# Altium schematic sheet e3_tp1_ej1.SchDoc
size A
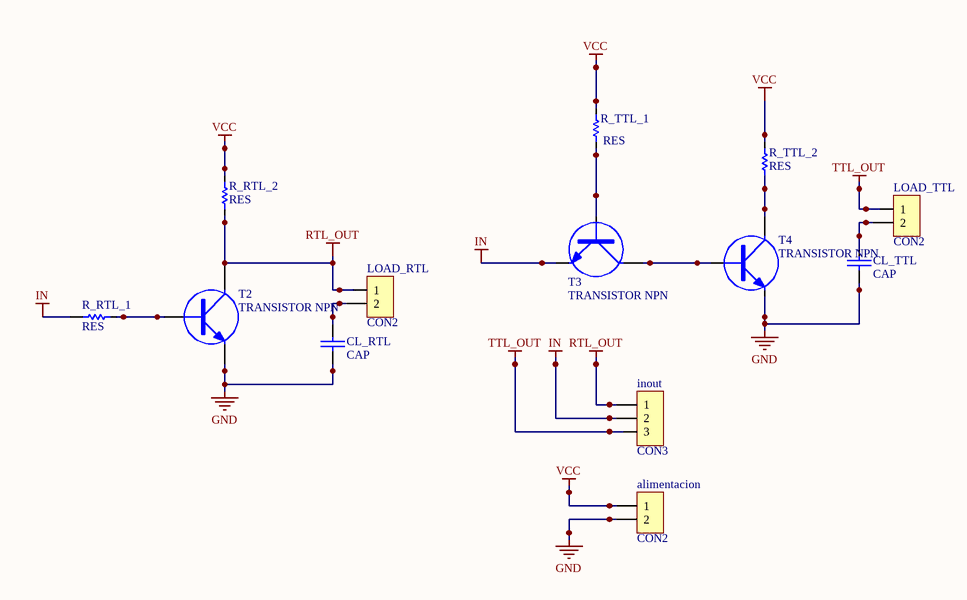
[diagram p0: e3_tp1_ej1.SchDoc]

## Parts
alimentacion  CON2  [SIP2]
CL_RTL  CAP  [CAP200]
CL_TTL  CAP  [CAP200]
inout  CON3  [SIP3]
LOAD_RTL  CON2  [SIP2]
LOAD_TTL  CON2  [SIP2]
R_RTL_1  RES  [RES300]
R_RTL_2  RES  [RES300]
R_TTL_1  RES  [RES300]
R_TTL_2  RES  [RES300]
T2  TRANSISTOR NPN  [TO92]
T3  TRANSISTOR NPN  [TO92]
T4  TRANSISTOR NPN  [TO92]

## Nets
GND: alimentacion.2 CL_RTL.2 CL_TTL.2 T2.3(E) T4.3(E)
IN: inout.2 R_RTL_1.1 T3.3(E)
RTL_OUT: inout.1 LOAD_RTL.1 R_RTL_2.1 T2.2(C)
TTL_OUT: inout.3 LOAD_TTL.1
VCC: alimentacion.1 R_RTL_2.2 R_TTL_1.2 R_TTL_2.2
NetCL_RTL_1: CL_RTL.1 LOAD_RTL.2
NetCL_TTL_1: CL_TTL.1 LOAD_TTL.2
NetR_RTL_1_2: R_RTL_1.2 T2.1(B)
NetR_TTL_1_1: R_TTL_1.1 T3.1(B)
NetR_TTL_2_1: R_TTL_2.1 T4.2(C)
NetT3_2: T3.2(C) T4.1(B)